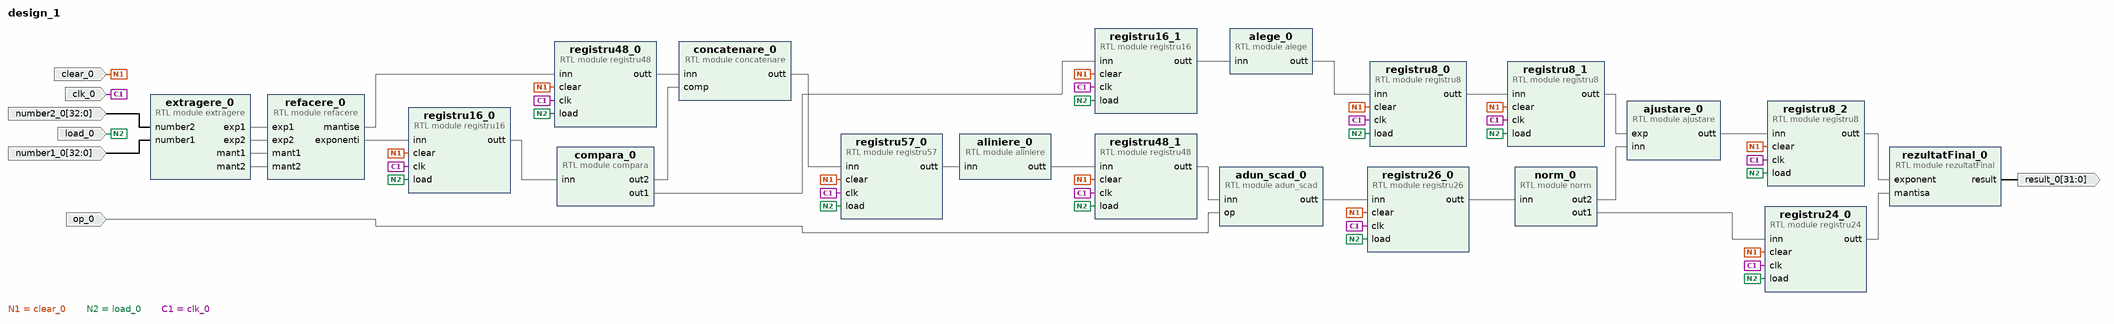
[diagram p0: block diagram of the top level]
# Vivado block design design_1, xc7a100tcsg324-1, Vivado 2020.2
create_bd_design design_1

create_bd_port -dir I clear_0
create_bd_port -dir I load_0
create_bd_port -dir I -type clk clk_0
create_bd_port -dir I op_0
create_bd_port -dir I -from 32 -to 0 number2_0
create_bd_port -dir I -from 32 -to 0 number1_0
create_bd_port -dir O -from 31 -to 0 result_0

create_bd_cell -type module -reference extragere extragere_0
create_bd_cell -type module -reference refacere refacere_0
create_bd_cell -type module -reference rezultatFinal rezultatFinal_0
create_bd_cell -type module -reference registru16 registru16_0
create_bd_cell -type module -reference registru16 registru16_1
create_bd_cell -type module -reference registru48 registru48_0
create_bd_cell -type module -reference registru48 registru48_1
create_bd_cell -type module -reference compara compara_0
create_bd_cell -type module -reference concatenare concatenare_0
create_bd_cell -type module -reference registru57 registru57_0
create_bd_cell -type module -reference alege alege_0
create_bd_cell -type module -reference aliniere aliniere_0
create_bd_cell -type module -reference registru8 registru8_0
create_bd_cell -type module -reference registru8 registru8_1
create_bd_cell -type module -reference registru8 registru8_2
create_bd_cell -type module -reference adun_scad adun_scad_0
create_bd_cell -type module -reference registru26 registru26_0
create_bd_cell -type module -reference norm norm_0
create_bd_cell -type module -reference ajustare ajustare_0
create_bd_cell -type module -reference registru24 registru24_0

# ---- connections ----

connect_bd_net -net clear_0_1 [get_bd_ports clear_0] \
  [get_bd_pins registru16_0/clear] [get_bd_pins registru16_1/clear] [get_bd_pins registru48_0/clear] \
  [get_bd_pins registru48_1/clear] [get_bd_pins registru57_0/clear] [get_bd_pins registru8_0/clear] \
  [get_bd_pins registru8_1/clear] [get_bd_pins registru8_2/clear] [get_bd_pins registru26_0/clear] \
  [get_bd_pins registru24_0/clear]
connect_bd_net -net load_0_1 [get_bd_ports load_0] \
  [get_bd_pins registru16_0/load] [get_bd_pins registru16_1/load] [get_bd_pins registru48_0/load] \
  [get_bd_pins registru48_1/load] [get_bd_pins registru57_0/load] [get_bd_pins registru8_0/load] \
  [get_bd_pins registru8_1/load] [get_bd_pins registru8_2/load] [get_bd_pins registru26_0/load] \
  [get_bd_pins registru24_0/load]
connect_bd_net -net clk_0_1 [get_bd_ports clk_0] \
  [get_bd_pins registru16_0/clk] [get_bd_pins registru16_1/clk] [get_bd_pins registru48_0/clk] [get_bd_pins registru48_1/clk] \
  [get_bd_pins registru57_0/clk] [get_bd_pins registru8_0/clk] [get_bd_pins registru8_1/clk] [get_bd_pins registru8_2/clk] \
  [get_bd_pins registru26_0/clk] [get_bd_pins registru24_0/clk]
connect_bd_net [get_bd_pins compara_0/out2] [get_bd_pins concatenare_0/comp]
connect_bd_net [get_bd_pins compara_0/out1] [get_bd_pins registru16_1/inn]
connect_bd_net -net op_0_1 [get_bd_ports op_0] [get_bd_pins adun_scad_0/op]
connect_bd_net -net registru8_1_out [get_bd_pins registru8_1/outt] [get_bd_pins ajustare_0/exp]
connect_bd_net [get_bd_pins norm_0/out1] [get_bd_pins registru24_0/inn]
connect_bd_net [get_bd_pins norm_0/out2] [get_bd_pins ajustare_0/inn]
connect_bd_net -net number2_0_1 [get_bd_ports number2_0] [get_bd_pins extragere_0/number2]
connect_bd_net -net number1_0_1 [get_bd_ports number1_0] [get_bd_pins extragere_0/number1]
connect_bd_net [get_bd_pins extragere_0/exp1] [get_bd_pins refacere_0/exp1]
connect_bd_net [get_bd_pins extragere_0/exp2] [get_bd_pins refacere_0/exp2]
connect_bd_net [get_bd_pins extragere_0/mant1] [get_bd_pins refacere_0/mant1]
connect_bd_net [get_bd_pins extragere_0/mant2] [get_bd_pins refacere_0/mant2]
connect_bd_net [get_bd_pins refacere_0/mantise] [get_bd_pins registru48_0/inn]
connect_bd_net [get_bd_pins refacere_0/exponenti] [get_bd_pins registru16_0/inn]
connect_bd_net -net registru24_0_out [get_bd_pins registru24_0/outt] [get_bd_pins rezultatFinal_0/mantisa]
connect_bd_net -net registru8_2_out [get_bd_pins registru8_2/outt] [get_bd_pins rezultatFinal_0/exponent]
connect_bd_net [get_bd_pins rezultatFinal_0/result] [get_bd_ports result_0]
connect_bd_net [get_bd_pins registru48_0/outt] [get_bd_pins concatenare_0/inn]
connect_bd_net [get_bd_pins concatenare_0/outt] [get_bd_pins registru57_0/inn]
connect_bd_net [get_bd_pins registru16_0/outt] [get_bd_pins compara_0/inn]
connect_bd_net [get_bd_pins registru16_1/outt] [get_bd_pins alege_0/inn]
connect_bd_net [get_bd_pins registru57_0/outt] [get_bd_pins aliniere_0/inn]
connect_bd_net [get_bd_pins aliniere_0/outt] [get_bd_pins registru48_1/inn]
connect_bd_net [get_bd_pins alege_0/outt] [get_bd_pins registru8_0/inn]
connect_bd_net [get_bd_pins registru48_1/outt] [get_bd_pins adun_scad_0/inn]
connect_bd_net [get_bd_pins registru8_0/outt] [get_bd_pins registru8_1/inn]
connect_bd_net [get_bd_pins adun_scad_0/outt] [get_bd_pins registru26_0/inn]
connect_bd_net [get_bd_pins registru26_0/outt] [get_bd_pins norm_0/inn]
connect_bd_net [get_bd_pins ajustare_0/outt] [get_bd_pins registru8_2/inn]

validate_bd_design
save_bd_design
